# Altium schematic sheet taczmi_sch_draft_20210426.SchDoc: +5V power supply
size A4; Engineer: M. Folejewski; DocumentNumber: 15; SheetNumber: 15; SheetTotal: 16; PageSize: A4; Designators: 900-949
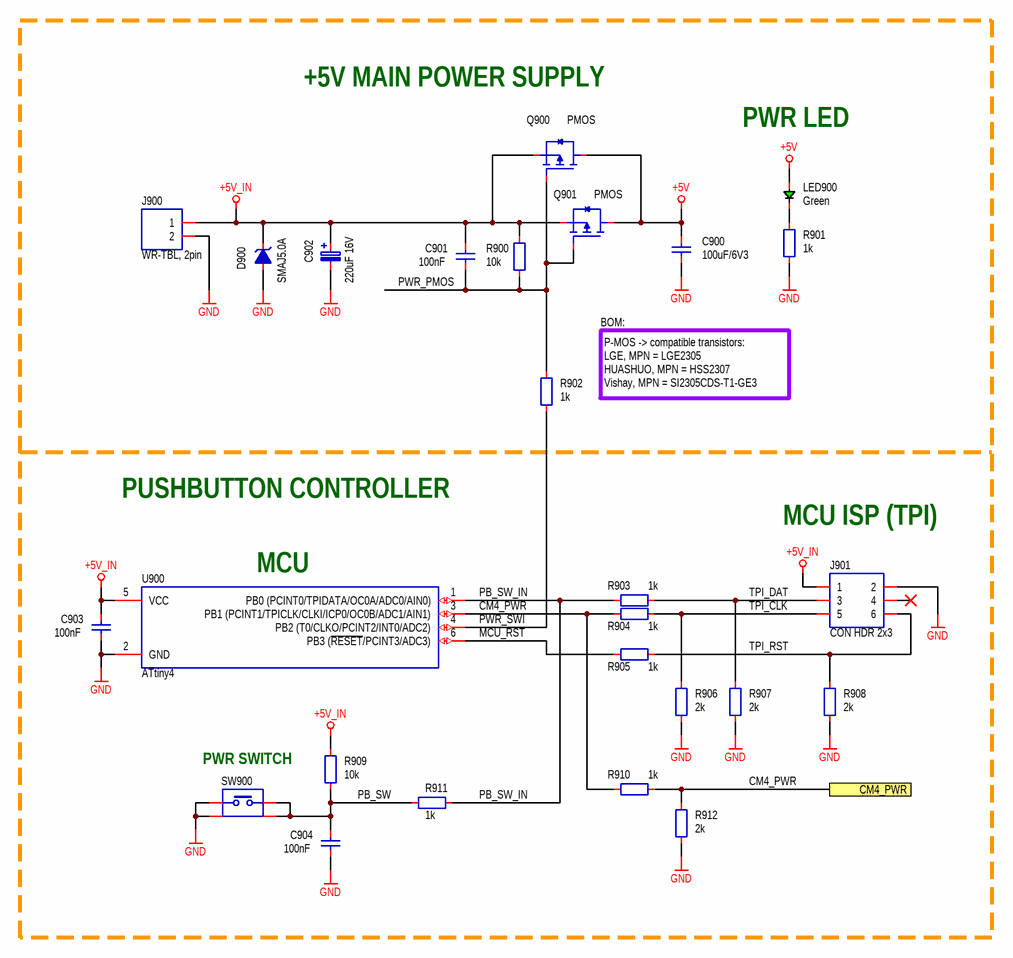
[diagram p0: taczmi_sch_draft_20210426.SchDoc]

## Parts
C900  100uF/6V3  [CAP_1206_R]
C901  100nF  [CAP_0603_R]
C902  220uF 16V  [CAP_RAD_D630H750P250_R]
C903  100nF  [CAP_0603_R]
C904  100nF  [CAP_0603_R]
D900  SMAJ5.0A  [DIO_SMA_UNI_R]
J900  WR-TBL, 2pin  [CON_WRT_691305140002]
J901  CON HDR 2x3
LED900  Green  [LED_0805_GRN_R]
Q900  PMOS  [PKG_SOT23-3_TO236]
Q901  PMOS  [PKG_SOT23-3_TO236]
R900  10k  [RES_0603_R]
R901  1k  [RES_0603_R]
R902  1k  [RES_0603_R]
R903  1k  [RES_0603_R]
R904  1k  [RES_0603_R]
R905  1k  [RES_0603_R]
R906  2k  [RES_0603_R]
R907  2k  [RES_0603_R]
R908  2k  [RES_0603_R]
R909  10k  [RES_0603_R]
R910  1k  [RES_0603_R]
R911  1k  [RES_0603_R]
R912  2k  [RES_0603_R]
SW900  (no value)
U900  ATtiny4  [PKG_SOT23-6]

## Ports
CM4_PWR

## Nets
+5V: C900.2 LED900.2 Q900.3(D) Q901.3(D)
+5V_IN: C901.2 C902.2 C903.2 D900.1(K) J900.1 J901.1 Q900.2(S) Q901.2(S) R900.2 R909.2 U900.5(VCC)
GND: C900.1 C902.1 C903.1 C904.1 D900.2(A) J900.2 J901.2 R901.2 R906.1 R907.1 R908.1 R912.1 SW900.1(SW1) SW900.3(FRM1) U900.2(GND)
CM4_PWR: R904.2 R910.1 R910.2 R912.2 U900.3(PB1_(PCINT1/TPICLK/CLKI/ICP0/OC0B/ADC1/AIN1)) ; port CM4_PWR
MCU_RST: R905.2 U900.6(PB3_(~{RESET}/PCINT3/ADC3))
PB_SW: C904.2 R909.1 R911.1 SW900.2(SW2) SW900.4(FRM2)
PB_SW_IN: R903.2 R911.2 U900.1(PB0_(PCINT0/TPIDATA/OC0A/ADC0/AIN0))
PWR_PMOS: C901.1 Q900.1(G) Q901.1(G) R900.1 R902.2
PWR_SWI: R902.1 U900.4(PB2_(T0/CLKO/PCINT2/INT0/ADC2))
TPI_CLK: J901.5 R904.1 R906.2
TPI_DAT: J901.3 R903.1 R907.2
TPI_RST: J901.6 R905.1 R908.2
NetLED900_1: LED900.1 R901.1

Not connected (* = marked no-connect by the designer): J901 4*

## Notes on the sheet
- +5V MAIN POWER SUPPLY
- PWR LED
- BOM:
- P-MOS -> compatible transistors:
  LGE, MPN = LGE2305
  HUASHUO, MPN = HSS2307
  Vishay, MPN = SI2305CDS-T1-GE3
- PUSHBUTTON CONTROLLER
- MCU ISP (TPI)
- (near U900) MCU
- PWR SWITCH

## Library data of the parts
C900 = CAP-0025: Capacitor; MLCC; GENERIC; TBD; TBD; TBD; TBD; SMD; 1206 (3216);; Component Type: Capacitor; Component Subtype: MLCC; Value: 100uF/6V3; Manufacturer: GENERIC; MPN: GENERIC; Mounting Type: SMD; Package (Case): 1206 (3216); Supplier: ?
C901 C903 C904 = CAP-0008: Capacitor; MLCC; 100nF; TBD; TBD; TBD; TBD; SMD; 0603 (1608);; Component Type: Capacitor; Component Subtype: MLCC; Value: 100nF; Manufacturer: TBD; MPN: TBD; Mounting Type: SMD; Package (Case): 0603 (1608); Supplier: ?
C902 = CAP_POL_2P_NP: Capacitor; Polarized;; Manufacturer: SUNCON; MPN: 16ME220SAX; Component Subtype: Electrolytic; Package (Case): THT (6.3x7.0mm); Component Type: Capacitor; Mounting Type: THT; Supplier: LCSC; Value: 220uF 16V
D900 = DIO_TVS_UNI_KA: Diode; Schottky; Unipolar;; Manufacturer: Littelfuse; Component Subtype: TVS Diode; Value: SMAJ5.0A; MPN: SMAJ5.0A; Component Type: Diode; Mounting Type: SMD; Supplier: ?
J900 = CON_1X02_COL: Connector; 1 Row;; MPN: 691 305 140 002; Manufacturer: Wurth Elektronik; Component Subtype: Terminal Block; Value: WR-TBL, 2pin; Component Type: Connector; Mounting Type: SMD; Supplier: ?
J901 = CON_2X03_ROW: Connector; 2 Row;; Component Subtype: Pin Header; Package (Case): THT; Component Type: Connector; Mounting Type: THT; Value: CON HDR 2x3
LED900 = DIO_LED_GRN: Diode; LED; Green;; Component Subtype: LED Diode; Value: Green; Component Type: LED; Mounting Type: SMD; Supplier: ?
Q900 Q901 = TRA_PMOS_GSD: Transistor; PMOS;; Manufacturer: Vishay; MPN: SI2305CDS-T1-GE3; Component Subtype: P-MOSFET; Value: PMOS; Component Type: Transistor; Mounting Type: SMD; Supplier: ?
R900 R909 = RES-0028: Resistor; Thick Film; 10k; 1%; 100mW; 100PPM; 75V; Standard; SMD; 0603 (1608);; Manufacturer: Yageo Corporation; MPN: RC0603FR-0710KL; Component Type: Resistor; Component Subtype: Thick Film; Value: 10k; Mounting Type: SMD; Package (Case): 0603 (1608); Supplier: ?
R901-R905 R910 R911 = RES-0027: Resistor; Thick Film; 1k; 1%; 100mW; 100PPM; 75V; Standard; SMD; 0603 (1608);; Manufacturer: Yageo Corporation; MPN: TBD; Component Type: Resistor; Component Subtype: Thick Film; Value: 1k; Mounting Type: SMD; Package (Case): 0603 (1608); Supplier: ?
R906-R908 R912 = RES-0033: Resistor; Thick Film; 2k2; 1%; 100mW; 100PPM; 75V; Standard; SMD; 0603 (1608);; Manufacturer: Yageo Corporation; MPN: TBD; Component Type: Resistor; Component Subtype: Thick Film; Value: 2k; Mounting Type: SMD; Package (Case): 0603 (1608); Supplier: ?
SW900 = SWI_TACT_2P_SH: Switch; Tactile; Monostable; Shielded;; Component Type: Switch; Mounting Type: SMD; Package: SMD
U900 = ICC_MCP_ATTINY4_5_8_9_SOT-23: ICC; MCU;; Manufacturer: Microchip Technology; MPN: ATTINY4-TSHR; Package (Case): SOT23-6; Component Subtype: MCU; Component Type: IC; Mounting Type: SMD; Value: ATtiny4